# EAGLE schematic star-tracker-camera-board (EAGLE 9.6.2)
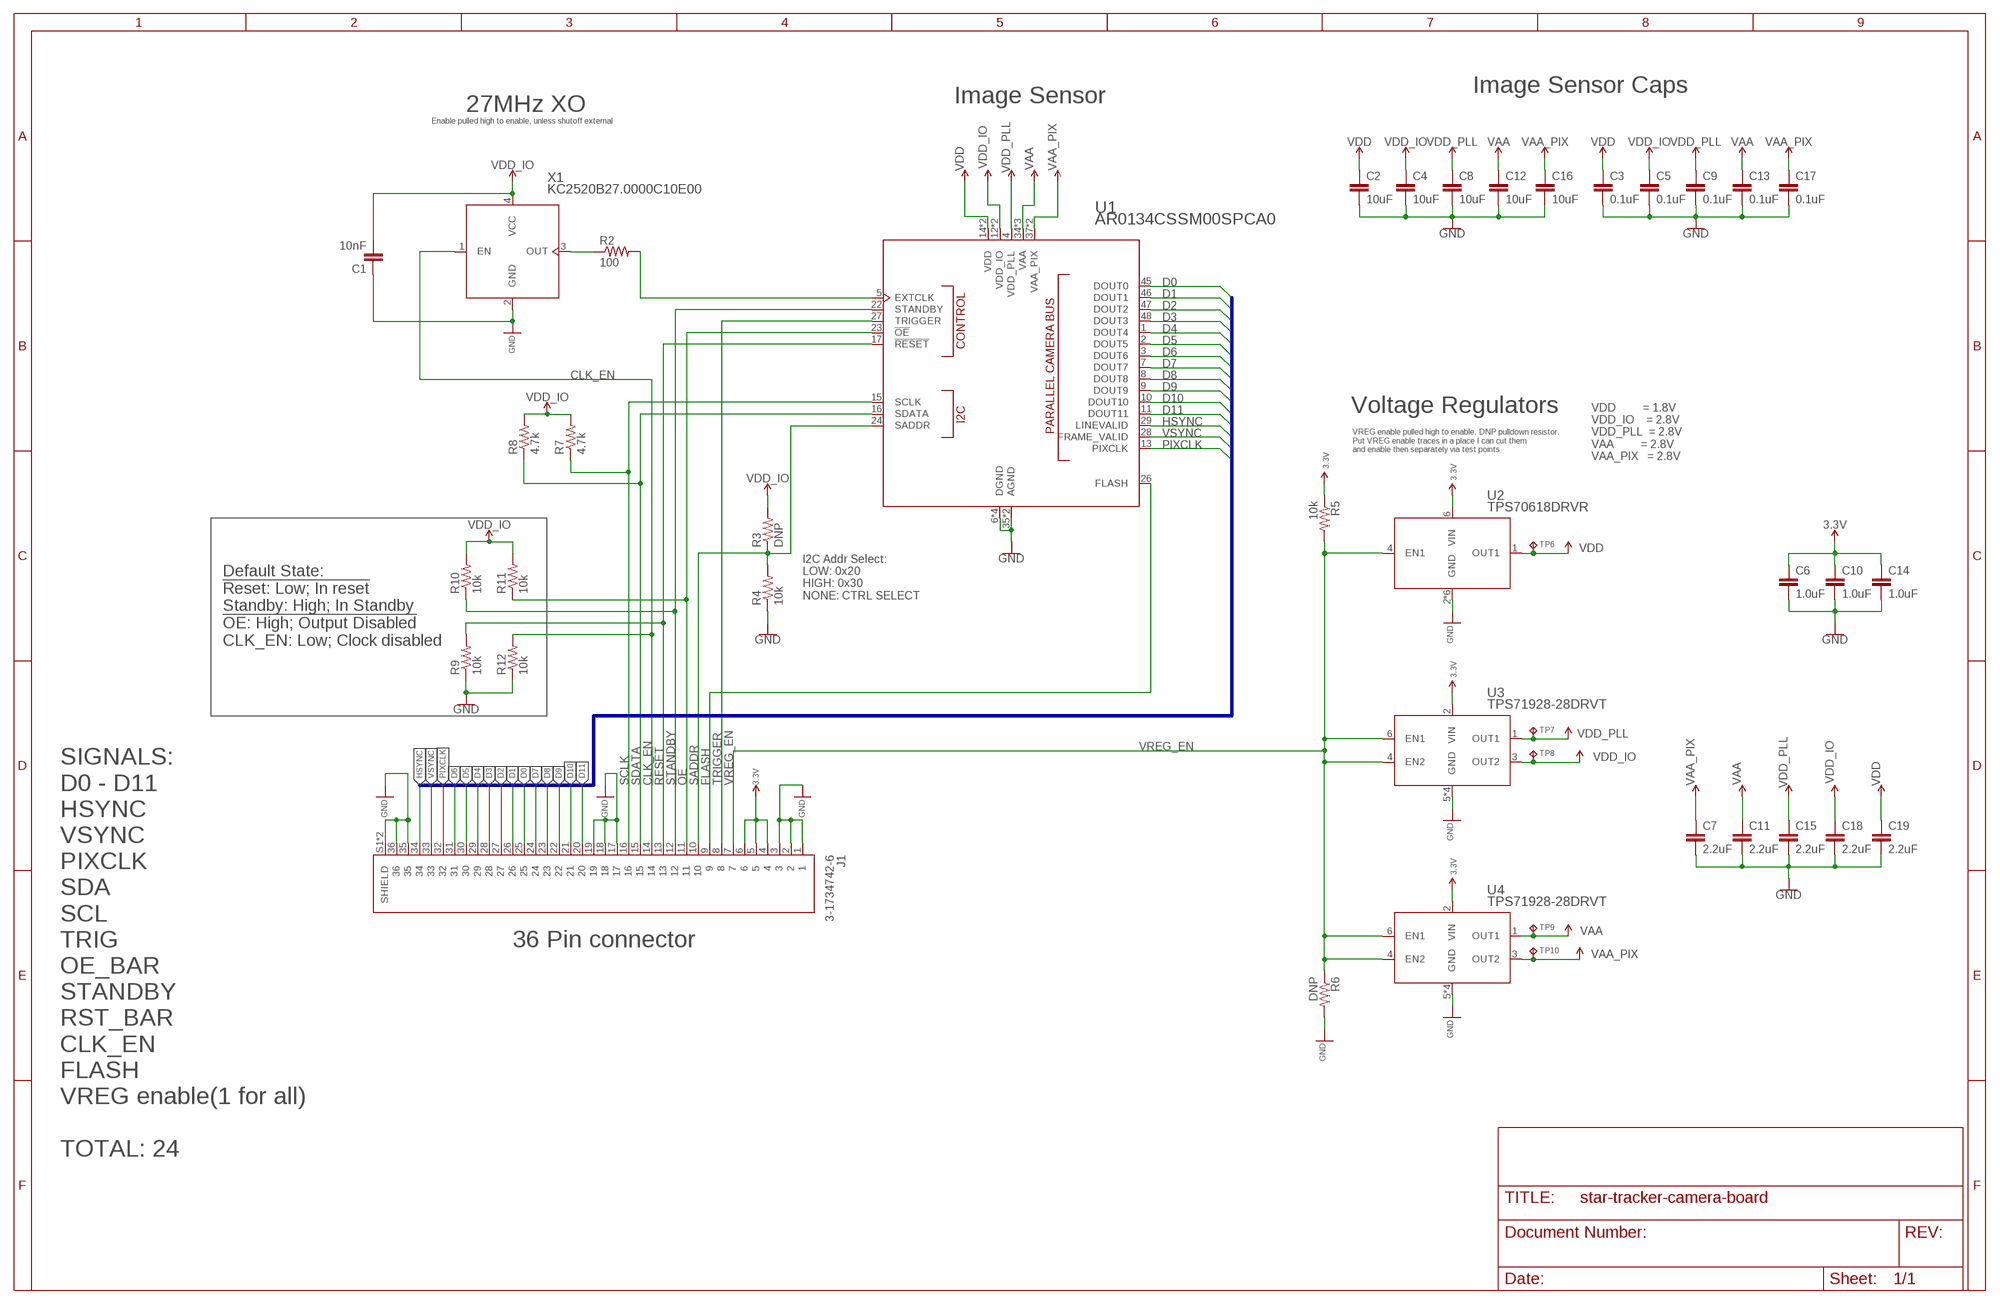
[diagram p0: schematic, sheet 1]

## Parts
C1  10nF  C-EU0402-A-NOSILK  [.0402-A-NOSILK]
C2  10uF  C-EU0603-C-NOSILK  [.0603-C-NOSILK]
C3  0.1uF  C-EU0402-B-NOSILK  [.0402-B-NOSILK]
C4  10uF  C-EU0603-C-NOSILK  [.0603-C-NOSILK]
C5  0.1uF  C-EU0402-B-NOSILK  [.0402-B-NOSILK]
C6  1.0uF  C-EU0603-C-NOSILK  [.0603-C-NOSILK]
C7  2.2uF  C-EU0603-C-NOSILK  [.0603-C-NOSILK]
C8  10uF  C-EU0603-C-NOSILK  [.0603-C-NOSILK]
C9  0.1uF  C-EU0402-B-NOSILK  [.0402-B-NOSILK]
C10  1.0uF  C-EU0603-C-NOSILK  [.0603-C-NOSILK]
C11  2.2uF  C-EU0603-C-NOSILK  [.0603-C-NOSILK]
C12  10uF  C-EU0603-C-NOSILK  [.0603-C-NOSILK]
C13  0.1uF  C-EU0402-B-NOSILK  [.0402-B-NOSILK]
C14  1.0uF  C-EU0603-C-NOSILK  [.0603-C-NOSILK]
C15  2.2uF  C-EU0603-C-NOSILK  [.0603-C-NOSILK]
C16  10uF  C-EU0603-C-NOSILK  [.0603-C-NOSILK]
C17  0.1uF  C-EU0402-B-NOSILK  [.0402-B-NOSILK]
C18  2.2uF  C-EU0603-C-NOSILK  [.0603-C-NOSILK]
C19  2.2uF  C-EU0603-C-NOSILK  [.0603-C-NOSILK]
J1  3-1734742-6  [TE_3-1734742-6]
R2  100  R-US_0402-B  [.0402-B]
R3  DNP  R-US_0402-B-NOSILK  [.0402-B-NOSILK]
R4  10k  R-US_0402-B-NOSILK  [.0402-B-NOSILK]
R5  10k  R-US_0402-B-NOSILK  [.0402-B-NOSILK]
R6  DNP  R-US_0402-B-NOSILK  [.0402-B-NOSILK]
R7  4.7k  R-US_0402-B-NOSILK  [.0402-B-NOSILK]
R8  4.7k  R-US_0402-B-NOSILK  [.0402-B-NOSILK]
R9  10k  R-US_0402-B  [.0402-B]
R10  10k  R-US_0402-B  [.0402-B]
R11  10k  R-US_0402-B  [.0402-B]
R12  10k  R-US_0402-B  [.0402-B]
TP6  TPTP06R  [TP06R]
TP7  TPTP06R  [TP06R]
TP8  TPTP06R  [TP06R]
TP9  TPTP06R  [TP06R]
TP10  TPTP06R  [TP06R]
U1  AR0134CSSM00SPCA0  [AR0134CSSM00SPCA0]
U2  TPS70618DRVR  [DRV6_1P6X1]
U3  TPS71928-28DRVT  [DRV6_1P6X1]
U4  TPS71928-28DRVT  [DRV6_1P6X1]
X1  KC2520B27.0000C10E00  [OSC_KYOCERA_KC2520B]

## Nets
3.3V: C6.1 C10.1 C14.1 J1.4 J1.5 J1.6 R5.1 U2.6(VIN) U3.2(VIN) U4.2(VIN)
!OE: J1.11 R11.1 U1.23(!OE)
!RESET: J1.13 R9.2 U1.17(!RESET)
CLK_EN: J1.14 R12.2 X1.1(EN)
D0: J1.25 U1.45(DOUT0)
D1: J1.26 U1.46(DOUT1)
D2: J1.27 U1.47(DOUT2)
D3: J1.28 U1.48(DOUT3)
D4: J1.29 U1.1(DOUT4)
D5: J1.30 U1.2(DOUT5)
D6: J1.31 U1.3(DOUT6)
D7: J1.24 U1.7(DOUT7)
D8: J1.23 U1.8(DOUT8)
D9: J1.22 U1.9(DOUT9)
D10: J1.21 U1.10(DOUT10)
D11: J1.20 U1.11(DOUT11)
FLASH: J1.9 U1.26(FLASH)
GND: C1.1 C2.2 C3.2 C4.2 C5.2 C6.2 C7.2 C8.2 C9.2 C10.2 C11.2 C12.2 C13.2 C14.2 C15.2 C16.2 C17.2 C18.2 C19.2 J1.1 J1.2 J1.3 J1.17 J1.18 J1.19 J1.35 J1.36 J1.S1(SHIELD) J1.S2(SHIELD) R4.1 R6.2 R9.1 R12.1 U1.6(DGND) U1.25(DGND) U1.30(DGND) U1.35(AGND) U1.39(AGND) U1.44(DGND) U2.2(GND) U2.3(GND) U2.5(GND) U2.7(GND) U2.8(GND) U2.9(GND) U3.5(GND) U3.7(GND) U3.8(GND) U3.9(GND) U4.5(GND) U4.7(GND) U4.8(GND) U4.9(GND) X1.2(GND)
HSYNC: J1.34 U1.29(LINEVALID)
N$1: R2.1 X1.3(OUT)
N$2: R2.2 U1.5(EXTCLK)
PIXCLK: J1.32 U1.13(PIXCLK)
SADDR: J1.10 R3.1 R4.2 U1.24(SADDR)
SCLK: J1.16 R7.1 U1.15(SCLK)
SDATA: J1.15 R8.1 U1.16(SDATA)
STANDBY: J1.12 R10.1 U1.22(STANDBY)
TRIGGER: J1.8 U1.27(TRIGGER)
VAA: C11.1 C12.1 C13.1 TP9.TP U1.34(VAA) U1.36(VAA) U1.40(VAA) U4.1(OUT1)
VAA_PIX: C7.1 C16.1 C17.1 TP10.TP U1.37(VAA_PIX) U1.38(VAA_PIX) U4.3(OUT2)
VDD: C2.1 C3.1 C19.1 TP6.TP U1.14(VDD) U1.19(VDD) U2.1(OUT1)
VDD_IO: C1.2 C4.1 C5.1 C18.1 R3.2 R7.2 R8.2 R10.2 R11.2 TP8.TP U1.12(VDD_IO) U1.18(VDD_IO) U3.3(OUT2) X1.4(VCC)
VDD_PLL: C8.1 C9.1 C15.1 TP7.TP U1.4(VDD_PLL) U3.1(OUT1)
VREG_EN: J1.7 R5.2 R6.1 U2.4(EN1) U3.4(EN2) U3.6(EN1) U4.4(EN2) U4.6(EN1)
VSYNC: J1.33 U1.28(FRAME_VALID)

## Buses
D[0..11],HSYNC,PIXCLK,VSYNC

## Notes on the sheet
- Image Sensor Caps
- Image Sensor
- 27MHz XO
- Enable pulled high to enable, unless shutoff external
- Voltage Regulators
- VREG enable pulled high to enable. DNP pulldown resistor. 
  Put VREG enable traces in a place I can cut them
  and enable then separately via test points
- VDD         = 1.8V
  VDD_IO    = 2.8V
  VDD_PLL  = 2.8V
  VAA         = 2.8V
  VAA_PIX   = 2.8V
- I2C Addr Select:
  LOW: 0x20
  HIGH: 0x30 
  NONE: CTRL SELECT
- Default State:
  !Reset: Low; In reset
  Standby: High; In Standby
  !OE: High; Output Disabled
  CLK_EN: Low; Clock disabled
- 36 Pin connector
- SIGNALS:
  D0 - D11
  HSYNC
  VSYNC
  PIXCLK
  SDA
  SCL
  TRIG
  OE_BAR
  STANDBY
  RST_BAR
  CLK_EN
  FLASH
  VREG enable(1 for all)
  
  TOTAL: 24

## Library data of the parts
C1-C19 = oresat-rcl:C-EU: CAPACITOR, European symbol
J1 = J-TEConnectivity-3-1734742-6 :3-1734742-6: 36 Position FFC, FPC Connector Contacts, Vertical, 1 Sided 0.020" (0.50mm) Surface Mount; DPN: A100241CT-ND; MPN: 3-1734742-6
R2-R12 = oresat-rcl:R-US_: RESISTOR, American symbol
TP6-TP10 = J-TestPoint-Small:TP: Test pad
U1 = U-ONSemi-AR0134:AR0134CSSM00SPCA0
U2 = U-TI-TPS70618-VoltageReg:TPS70618DRVR; DPN: 296-48768-1-ND; MPN: TPS70618DRVR; VENDOR: Texas Instruments
U3 U4 = U-TI-TPS71928-28-VoltageReg:TPS71928-28DRVT; DPN: 296-21660-1-ND; MPN: TPS71928-28DRVR; VENDOR: Texas Instruments
X1 = X-KYOCERA-KC2520B27:KC2520B27.0000C10E00; DPN: 478-4781-1-ND; MPN: KC2520B27.0000C10E00; VENDOR: Kyocera